# EAGLE design amebot (EAGLE 6.5.0)
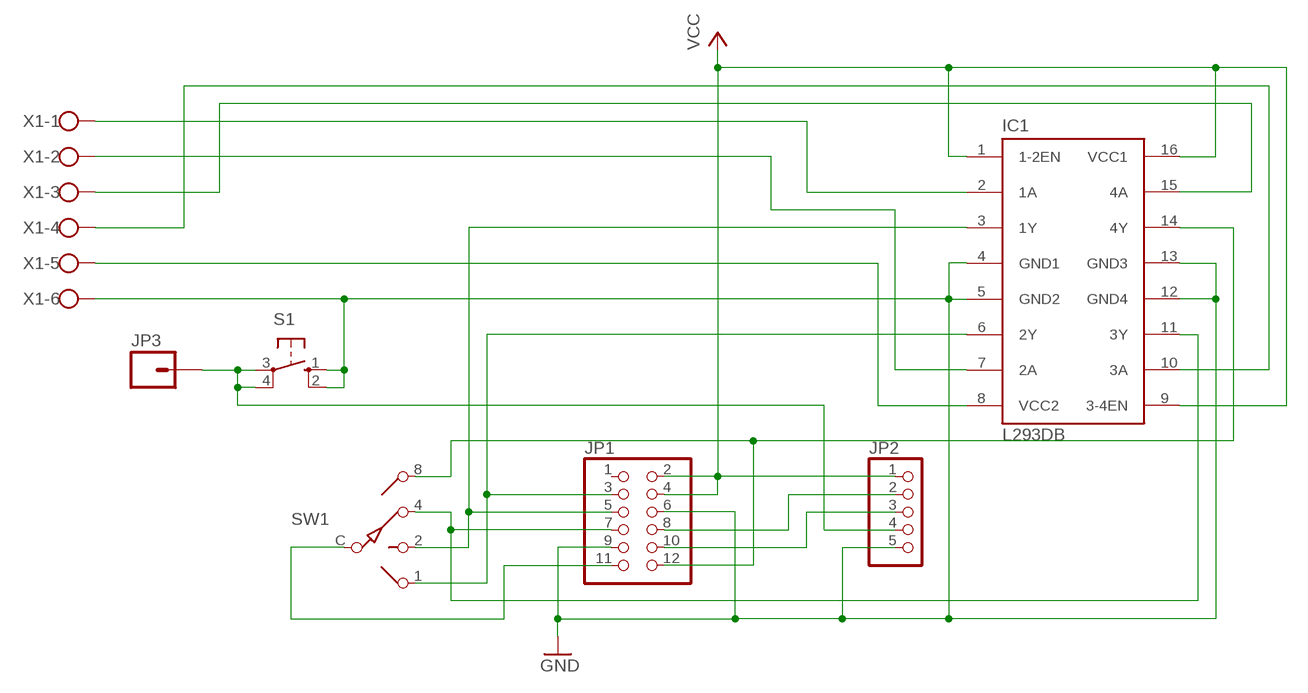
[diagram p0: schematic, sheet 1]

## Parts
IC1  L293DB  [DIL16VAR]
JP1  PINHD-2X6  [2X06]
JP2  PINHD-1X5  [1X05]
JP3  M01PTH_LONGPAD  [1X01_LONGPAD]
S1  10-XX  [B3F-10XX]
SW1  SW-C10  [SW-C10]
X1  W237-6  [W237-6]

## Nets
GND: IC1.4(GND1) IC1.5(GND2) IC1.12(GND4) IC1.13(GND3) JP1.6 JP1.9 JP2.5 S1.1(S) S1.2(S1) X1.6
N$2: JP2.4 JP3.1 S1.3(P) S1.4(P1)
N$3: IC1.6(2Y) JP1.3 SW1.1
N$4: IC1.3(1Y) JP1.5 SW1.2
N$5: JP1.11 SW1.C
N$6: IC1.14(4Y) JP1.12 SW1.8
N$7: JP1.8 JP2.2
N$8: IC1.2(1A) X1.1
N$9: IC1.7(2A) X1.2
N$10: IC1.15(4A) X1.3
N$11: IC1.10(3A) X1.4
N$12: IC1.8(VCC2) X1.5
N$13: JP1.10 JP2.3
N$14: IC1.11(3Y) JP1.7 SW1.4
VCC: IC1.1(1-2EN) IC1.9(3-4EN) IC1.16(VCC1) JP1.2 JP1.4 JP2.1
Unconnected: JP1.1

## Library data of the parts
IC1 = st-microelectronics:L293D: PUSH-PULL 4 CHANNEL DRIVER
JP1 = pinhead:PINHD-2X6: PIN HEADER
JP2 = pinhead:PINHD-1X5: PIN HEADER
JP3 = SparkFun-Connectors:M01: Header 1 Standard 1-pin 0.1" header. Use with straight break away headers (SKU : PRT-00116), right angle break away headers (PRT-00553), swiss pins (PRT-00743), machine pins (PRT-00117), and female headers (PRT-00115).
S1 = switch-omron:10-XX: OMRON SWITCH; MPN: B3F-1000; OC_FARNELL: 176432; OC_NEWARK: 36M3542
SW1 = special:SW-C10: SWITCH 10-step rotary switch
X1 = con-wago-500:W237-6: WAGO SCREW CLAMP; OC_FARNELL: unknown; OC_NEWARK: unknown

## Board
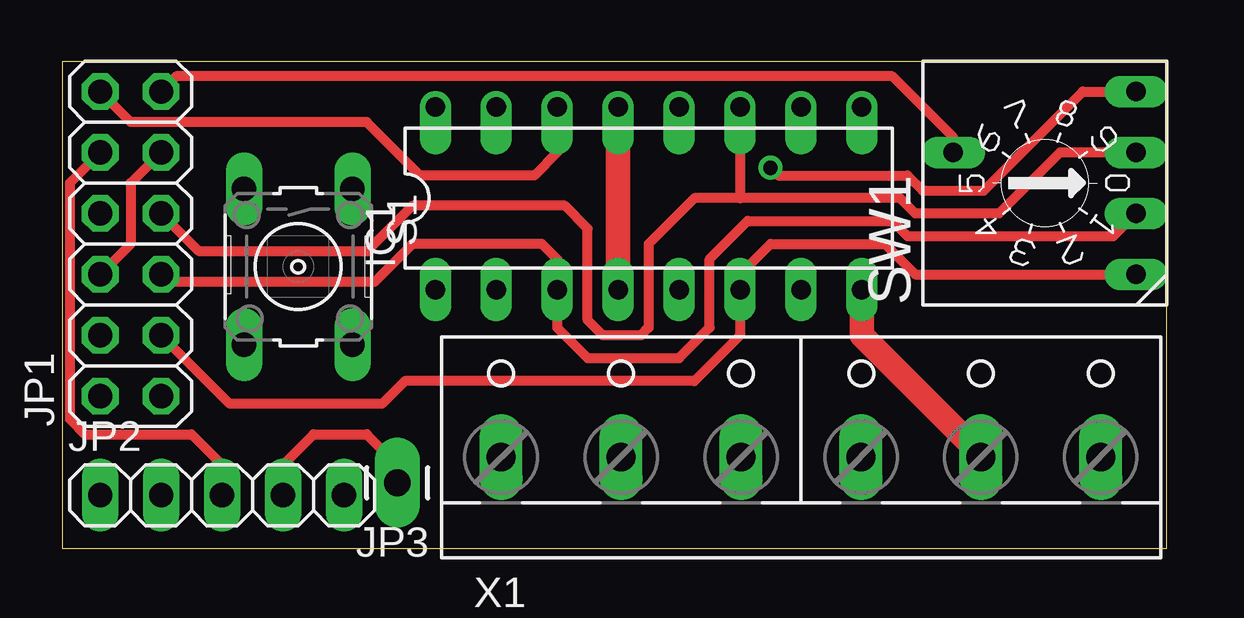
[diagram p1: board, top side]
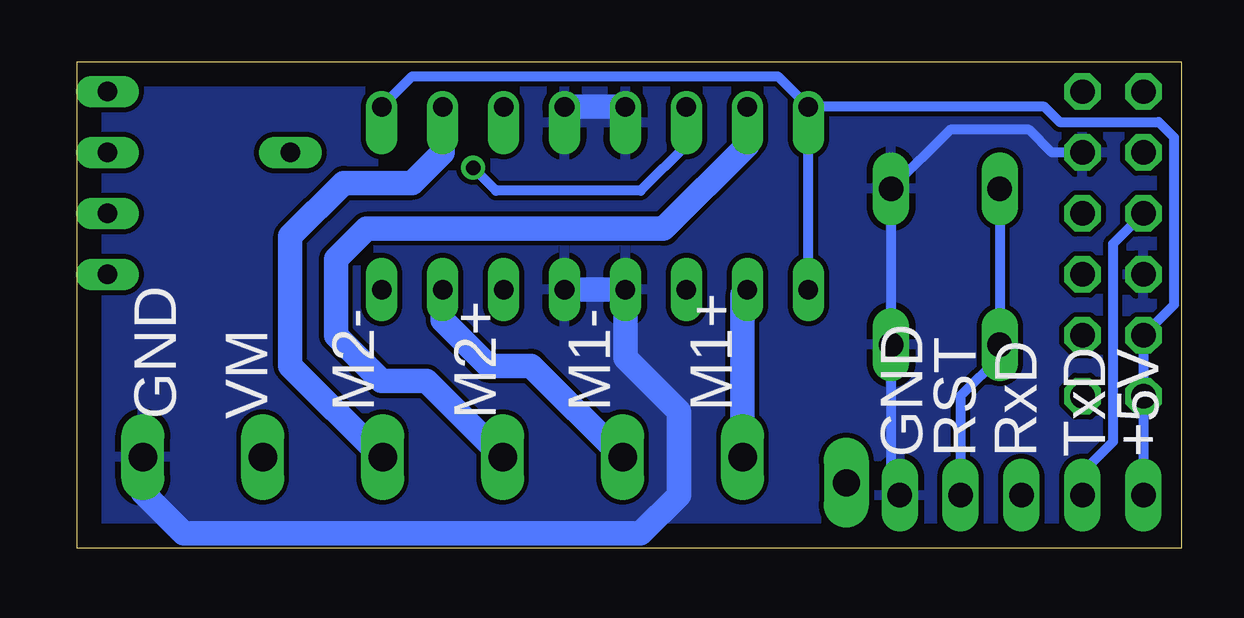
[diagram p2: board, bottom side, seen from below]

Size 46.02 x 20.3 mm. Coordinates in mm from the lower left corner, seen from the top.
Outline: 46.03,0 46.03,20.3 0,20.3 0,0 46.03,0
Copper layers (1*16): Top 0.035mm / dielectric 1.5mm / Bottom 0.035mm
Design rules "default": minimum track width 10mil, minimum drill 24mil, track to track 8mil, track to pad 8mil, pad to pad 8mil, via to via 8mil, smd to smd 8mil, copper to edge 40mil, drill to drill 8mil, minimum pad ring 10mil, minimum via ring 8mil, stop-mask expansion 4mil, vias tented up to drill 0mil, thermal gap 10mil

### Footprints (pad centres in the part's own frame; a part is rotated, then mirrored left to right if it is on the bottom)
DIL16VAR = drill 0.813 long: 1 -7.62,-3.81; 2 -5.08,-3.81; 3 -2.54,-3.81; 4 0,-3.81; 5 2.54,-3.81; 6 5.08,-3.81; 7 7.62,-3.81; 8 10.16,-3.81 | drill 0.813 offset: 9 10.16,3.81; 10 7.62,3.81; 11 5.08,3.81; 12 2.54,3.81; 13 0,3.81; 14 -2.54,3.81; 15 -5.08,3.81; 16 -7.62,3.81
2X06 = drill 1.016 octagon: 1 -6.35,-1.27; 2 -6.35,1.27; 3 -3.81,-1.27; 4 -3.81,1.27; 5 -1.27,-1.27; 6 -1.27,1.27; 7 1.27,-1.27; 8 1.27,1.27; 9 3.81,-1.27; 10 3.81,1.27; 11 6.35,-1.27; 12 6.35,1.27
1X05 = drill 1.016 long: 1 -5.08,0; 2 -2.54,0; 3 0,0; 4 2.54,0; 5 5.08,0
1X01_LONGPAD = drill 1.118 pad 1.88 long: 1 0,0
B3F-10XX = drill 1.016 long: 1 -3.251,2.261; 2 3.251,2.261; 3 -3.251,-2.261; 4 3.251,-2.261
SW-C10 = drill 0.813 long: 1 -3.81,-3.81; 2 -1.27,-3.81; 4 1.27,-3.81; 8 3.81,-3.81; C 1.27,3.81
W237-6 = drill 1.194 long: 1 -12.5,-1.27; 2 -7.5,-1.27; 3 -2.5,-1.27; 4 2.5,-1.27; 5 7.5,-1.27; 6 12.5,-1.27

### Placement (x,y rotation side)
IC1  23.16,14.61 0 top
JP1  2.84,12.7 90 top
JP2  6.66,2.22 0 top
JP3  13.96,2.74 180 top
S1  9.83,11.75 270 top
SW1  40.95,15.24 90 top
X1  30.79,5.08 0 top

### Tracks (layer width: path | path; a pad name or v marks a point on that pad's centre or on a via)
GND
  Top 0.406: JP1.9 2.84,15.24 2.84,12.7 JP1.6
  Top 1.016: IC1.13 IC1.4
  Bottom 0.406: JP1.9 5.38,16.51 6.34,17.46 9.63,17.46 S1.1 S1.2 12.09,2.58 JP2.5
  Bottom 1.016: X1.6 43.28,2.34 41.58,0.64 22.53,0.64 20.94,2.22 20.94,5.71 23.16,7.94 IC1.4 IC1.5 | IC1.12 IC1.13
  pour Bottom: 0.3,20 45.71,20 45.71,0.32 0.3,0.32
N$2
  Top 0.406: JP2.4 9.19,3.49 10.46,4.76 12.69,4.76 13.96,3.49 JP3.1
  Bottom 0.406: S1.3 S1.4 7.57,7.98 9.19,6.35 JP2.4
N$3
  Top 0.406: JP1.3 6.97,6.03 13.32,6.03 14.27,6.99 26.34,6.99 28.25,8.89 IC1.6 28.25,11.43 29.51,12.7 34.28,12.7 35.55,11.43 SW1.1
N$4
  Top 0.406: JP1.5 4.43,11.11 13.01,11.11 14.59,12.7 19.99,12.7 20.62,12.06 IC1.3 20.62,9.21 21.89,7.94 25.71,7.94 26.98,9.21 26.98,12.06 28.56,13.65 34.6,13.65 35.23,13.02 43.8,13.02 SW1.2
N$5
  Top 0.406: SW1.C 37.14,17.14 34.6,19.68 4.75,19.68 JP1.11
N$6  (via drill 0.6)
  Top 0.406: IC1.14 20.62,16.51 19.67,15.56 14.91,15.56 12.69,17.78 2.84,17.78 JP1.12 | v29.51,15.88 29.83,15.56 35.23,15.56 35.86,14.92 38.4,14.92 42.53,19.05 SW1.8
  Bottom 0.406: IC1.14 20.62,16.83 22.53,14.92 28.56,14.92 v29.51,15.88
N$7
  Bottom 0.406: JP1.8 2.84,12.7 2.84,4.45 4.12,3.17 JP2.2
N$8
  Bottom 1.016: X1.1 18.28,10.6 IC1.2
N$9
  Bottom 1.016: IC1.7 30.78,9.53 28.88,7.62 27.1,7.62 X1.2
N$10
  Bottom 1.016: X1.3 31.46,6.99 33.32,6.99 35.23,8.89 35.23,12.06 33.96,13.34 21.58,13.34 18.09,16.83 IC1.15
N$11
  Bottom 1.016: X1.4 33.32,3.81 37.14,7.62 37.14,13.02 34.91,15.24 32.06,15.24 30.78,16.51 IC1.10
N$12
  Top 1.016: X1.5 38.28,3.93 33.32,8.89 IC1.8
N$13
  Top 0.406: JP1.10 0.31,15.24 0.31,5.4 0.94,4.76 5.38,4.76 6.66,3.49 JP2.3
N$14
  Top 0.406: IC1.11 28.25,14.61 | JP1.7 5.7,12.38 12.69,12.38 14.59,14.29 20.94,14.29 21.89,13.34 21.89,9.53 22.53,8.89 24.12,8.89 24.44,9.21 24.44,12.7 26.34,14.61 28.25,14.61 | SW1.4 41.58,16.51 39.04,13.97 35.55,13.97 34.91,14.61 28.25,14.61
VCC
  Bottom 0.406: JP2.1 JP1.2 JP1.4 0.31,10.16 0.31,17.14 0.94,17.78 5.07,17.78 5.7,18.41 IC1.16 | IC1.9 32.06,19.68 16.82,19.68 IC1.16 | IC1.1 IC1.16

### Text on the board
bPlace: M1+ | M1- | M2- | M2+ | VM | GND | +5V | TxD | RxD | RST | GND